# EAGLE schematic 28c16 uno shield programmer (EAGLE 9.5.1)
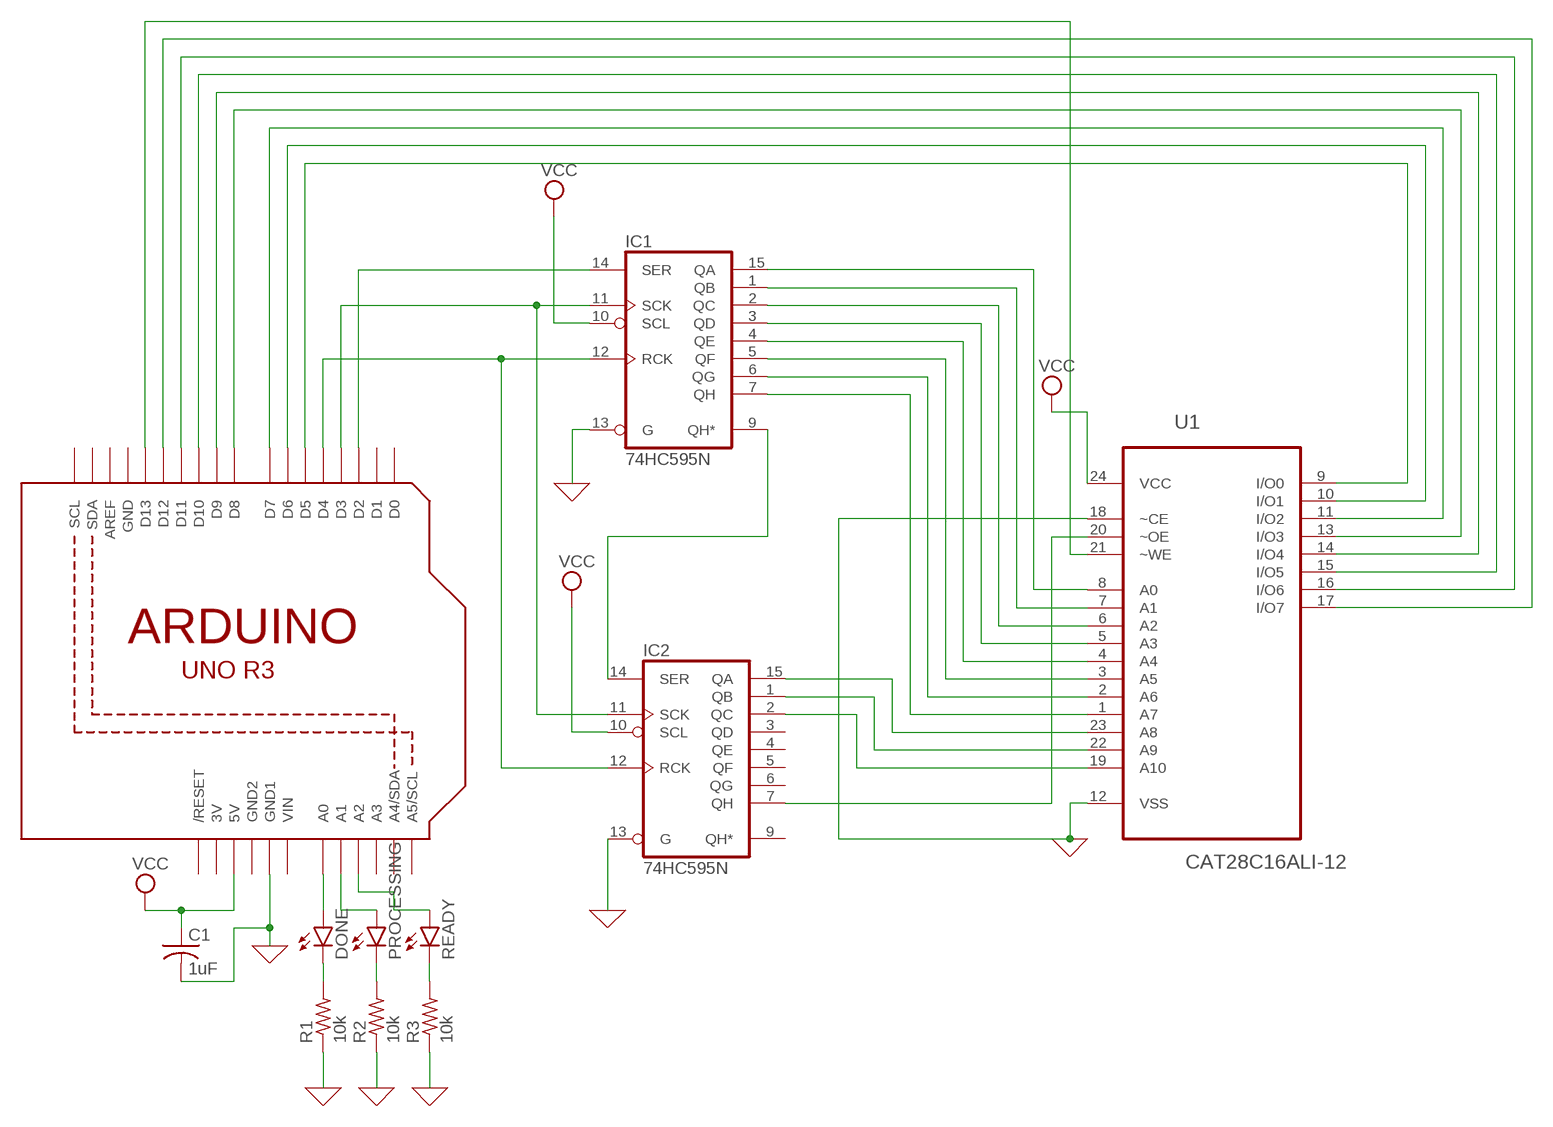
[diagram p0: schematic, sheet 1]

## Parts
C1  1uF  C-US050-025X075  [C050-025X075]
DONE  LED5MM  [LED5MM]
IC1  74HC595N  [DIL16]
IC2  74HC595N  [DIL16]
PROCESSING  LED5MM  [LED5MM]
Q1  ARDUINOR3-NOIOREF-NOTEXT  [ARDUINOR3-NOTEXT-NOIOREF]
R1  10k  R-US_0204/7  [0204/7]
R2  10k  R-US_0204/7  [0204/7]
R3  10k  R-US_0204/7  [0204/7]
READY  LED5MM  [LED5MM]
U1  CAT28C16ALI-12  [DIP254P1524X635-24]

## Nets
0: C1.2 IC1.13(G) IC2.13(G) Q1.GND1 R1.1 R2.1 R3.1 U1.12(VSS) U1.18(~CE) ; supply symbol labelled GND
N$1: DONE.A Q1.A0
N$2: DONE.K(C) R1.2
N$3: PROCESSING.K(C) R2.2
N$4: R3.2 READY.K(C)
N$5: PROCESSING.A Q1.A1
N$6: Q1.A2 READY.A
N$7: IC1.12(RCK) IC2.12(RCK) Q1.D4
N$8: IC1.11(SCK) IC2.11(SCK) Q1.D3
N$9: IC1.14(SER) Q1.D2
N$10: Q1.D11 U1.16(I/O6)
N$11: Q1.D12 U1.17(I/O7)
N$12: IC1.9(QH*) IC2.14(SER)
N$13: IC1.15(QA) U1.8(A0)
N$14: IC1.1(QB) U1.7(A1)
N$15: IC1.2(QC) U1.6(A2)
N$16: IC1.3(QD) U1.5(A3)
N$17: IC1.4(QE) U1.4(A4)
N$18: IC1.5(QF) U1.3(A5)
N$19: IC1.6(QG) U1.2(A6)
N$20: IC1.7(QH) U1.1(A7)
N$21: IC2.15(QA) U1.23(A8)
N$22: IC2.1(QB) U1.22(A9)
N$23: IC2.2(QC) U1.19(A10)
N$24: Q1.D13 U1.21(~WE)
N$25: IC2.7(QH) U1.20(~OE)
N$26: Q1.D10 U1.15(I/O5)
N$27: Q1.D9 U1.14(I/O4)
N$28: Q1.D8 U1.13(I/O3)
N$29: Q1.D7 U1.11(I/O2)
N$30: Q1.D6 U1.10(I/O1)
N$31: Q1.D5 U1.9(I/O0)
VCC: C1.1 IC1.10(SCL) IC2.10(SCL) Q1.5V U1.24(VCC)
Unconnected: IC2.3(QD) IC2.4(QE) IC2.5(QF) IC2.6(QG) IC2.9(QH*) Q1.A3 Q1.A4(A4/SDA) Q1.A5(A5/SCL) Q1.AREF Q1.D0 Q1.D1 Q1.RESET(/RESET) Q1.SCL Q1.SDA

## Power pins joined to a net without a drawn wire
3V: Q1.3V
GND: IC1.8(GND) IC2.8(GND) Q1.GND
GND2: Q1.GND2
VCC: IC1.16(VCC) IC2.16(VCC)
VIN: Q1.VIN

## Library data of the parts
C1 = adafruit:C-US: CAPACITOR, American symbol
DONE PROCESSING READY = led:LED: LED OSRAM: - CHIPLED LG R971, LG N971, LY N971, LG Q971, LY Q971, LO R971, LY R971 LH N974, LH R974 LS Q976, LO Q976, LY Q976 LO Q996 - Hyper CHIPLED LW Q18S LB Q993, LB Q99A, LB R99A - SideLED LS A670, LO A670, LY A670, LG A670, LP A670 LB A673, LV A673, LT A673, LW A673 LH A674 LY A675 LS A676, LA A676, LO A676, LY A676, LW A676 LS A679, LY A679, LG A679 - Hyper Micro SIDELED® LS Y876, LA Y876, LO Y876, LY Y876 LT Y87S - SmartLED LW L88C, LW L88S LB L89C, LB L89S, LG L890 LS L89K, LO L89K, LY L89K LS L896, LA L896, LO L896, LY L896 - TOPLED LS T670, LO T670, LY T670, LG T670, LP T670 LSG T670, LSP T670, LSY T670, LOP T670, LYG T670 LG T671, LOG T671, LSG T671 LB T673, LV T673, LT T673, LW T673 LH T674 LS T676, LA T676, LO T676, LY T676, LB T676, LH T676, LSB T676, LW T676 LB T67C, LV T67C, LT T67C, LS T67K, LO T67K, LY T67K, LW E67C LS E67B, LA E67B, LO E67B, LY E67B, LB E67C, LV E67C, LT E67C LW T67C LS T679, LY T679, LG T679 LS T770, LO T770, LY T770, LG T770, LP T770 LB T773, LV T773, LT T773, LW T773 LH T774 LS E675, LA E675, LY E675, LS T675 LS T776, LA T776, LO T776, LY T776, LB T776 LHGB T686 LT T68C, LB T68C - Hyper Mini TOPLED® LB M676 - Mini TOPLED Santana® LG M470 LS M47K, LO M47K, LY M47K Source: http://www.osram.convergy.de LUXEON: - LUMILED® LXK2-PW12-R00, LXK2-PW12-S00, LXK2-PW14-U00, LXK2-PW14-V00 LXK2-PM12-R00, LXK2-PM12-S00, LXK2-PM14-U00 LXK2-PE12-Q00, LXK2-PE12-R00, LXK2-PE12-S00, LXK2-PE14-T00, LXK2-PE14-U00 LXK2-PB12-K00, LXK2-PB12-L00, LXK2-PB12-M00, LXK2-PB14-N00, LXK2-PB14-P00, LXK2-PB14-Q00 LXK2-PR12-L00, LXK2-PR12-M00, LXK2-PR14-Q00, LXK2-PR14-R00 LXK2-PD12-Q00, LXK2-PD12-R00, LXK2-PD12-S00 LXK2-PH12-R00, LXK2-PH12-S00 LXK2-PL12-P00, LXK2-PL12-Q00, LXK2-PL12-R00 Source: www.luxeon.com KINGBRIGHT: KA-3528ASYC Source: www.kingbright.com
IC1 IC2 = 74xx-eu:74*595: 8-bit SHIFT REGISTER, output latch
Q1 = adafruit:ARDUINOR3-NOIOREF
R1-R3 = adafruit:R-US_: RESISTOR, American symbol
U1 = CAT28C16ALI-12:CAT28C16ALI-12: 16 kb CMOS Parallel EEPROM Check availability <https://pricing.snapeda.com/parts/CAT28C16ALI12/ON%20Semiconductor/view-part?ref=eda>; AVAILABILITY: In Stock; DESCRIPTION: EEPROM Memory IC 16Kb (2K x 8) Parallel 120 ns 24-PDIP; MF: ON Semiconductor; MP: CAT28C16ALI12; PACKAGE: PDIP-24 Catalyst Semiconductor; PRICE: None; PURCHASE-URL: https://pricing.snapeda.com/search/part/CAT28C16ALI12/?ref=eda